# Altium schematic sheet Memory.SchDoc: SDRAM
size A4; Date: 9/24/2014; Author: P.A.; CompanyName: STMicroelectronics; Organization: Microcontrollers Division; Address1: 12, Rue Jules HOROWITZ; Address2: 38019 Grenoble; Address3: FRANCE; DocumentNumber: 9; Revision: B-07; SheetNumber: 9; SheetTotal: 13; Project: STM32F469I-DISCO
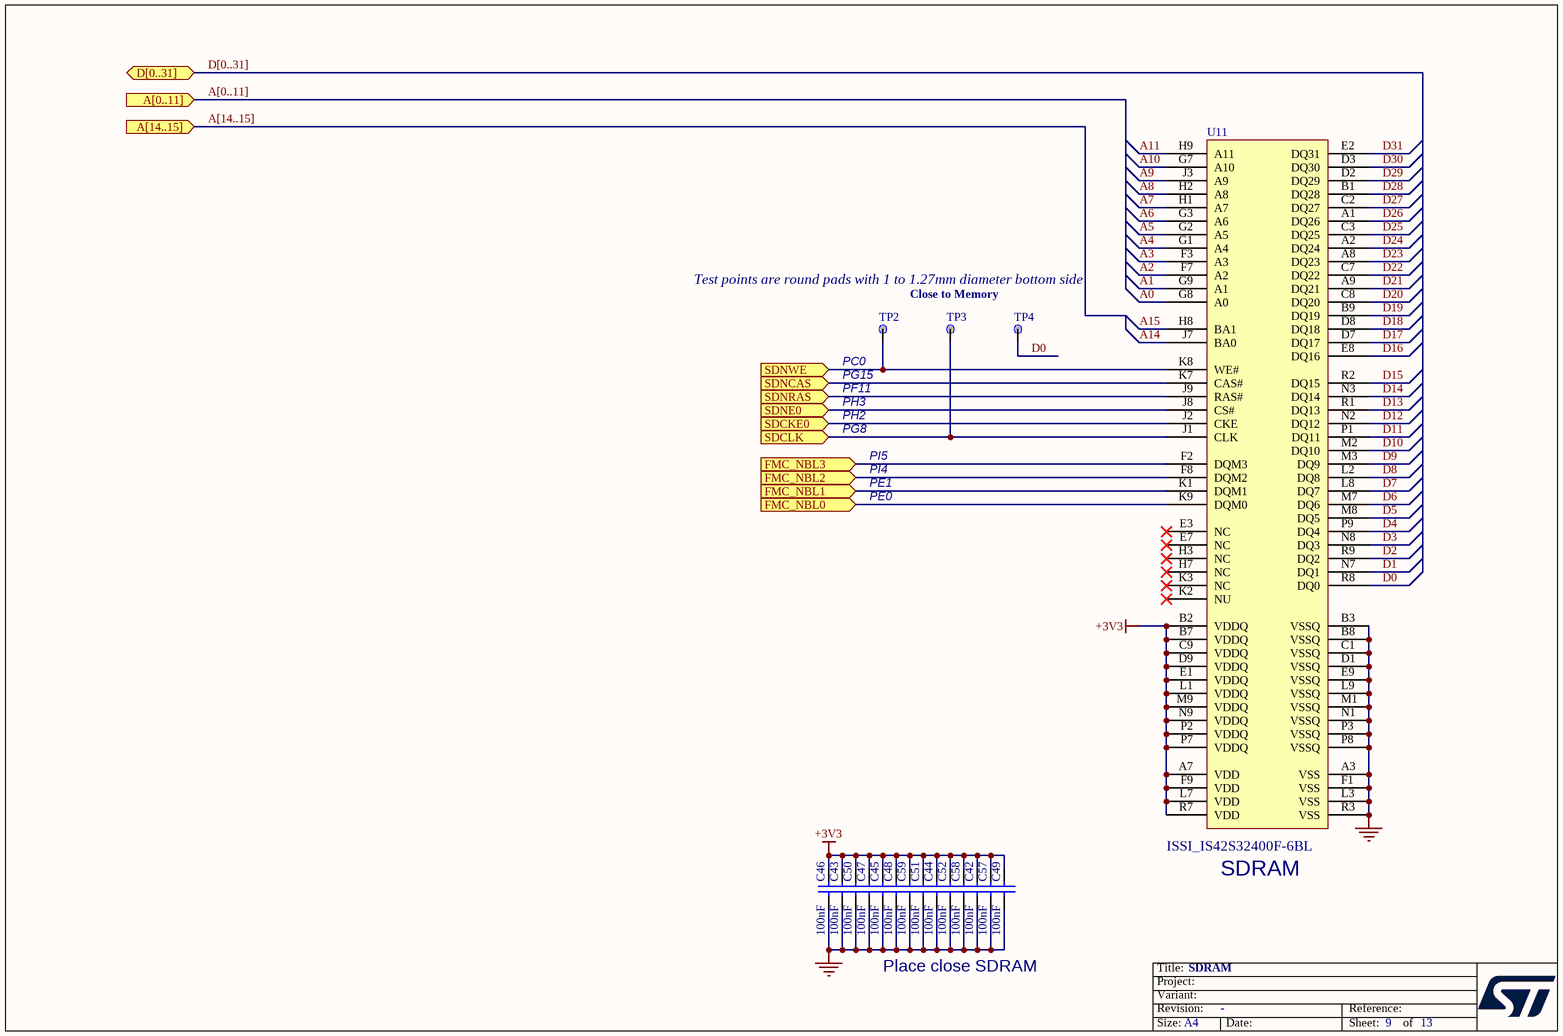
[diagram p0: Memory.SchDoc]

## Parts
C42  100nF  [0402C]
C43  100nF  [0402C]
C44  100nF  [0402C]
C45  100nF  [0402C]
C46  100nF  [0402C]
C47  100nF  [0402C]
C48  100nF  [0402C]
C49  100nF  [0402C]
C50  100nF  [0402C]
C51  100nF  [0402C]
C52  100nF  [0402C]
C57  100nF  [0402C]
C58  100nF  [0402C]
C59  100nF  [0402C]
TP2  TP  [TP_C40]  (value not drawn)
TP3  TP  [TP_C40]  (value not drawn)
TP4  TP  [TP_C40]  (value not drawn)
U11  ISSI_IS42S32400F-6BL  [FBGA90_0R8_8X13]

## Ports
A[0..11] (in), A[14..15] (in), D[0..31] (bidir), FMC_NBL0 (in), FMC_NBL1 (in), FMC_NBL2 (in), FMC_NBL3 (in), SDCKE0 (in), SDCLK (in), SDNCAS (in), SDNE0 (in), SDNRAS (in), SDNWE (in)

## Nets
+3V3: C42.1 C43.1 C44.1 C45.1 C46.1 C47.1 C48.1 C49.1 C50.1 C51.1 C52.1 C57.1 C58.1 C59.1 U11.A7(VDD) U11.B2(VDDQ) U11.B7(VDDQ) U11.C9(VDDQ) U11.D9(VDDQ) U11.E1(VDDQ) U11.F9(VDD) U11.L1(VDDQ) U11.L7(VDD) U11.M9(VDDQ) U11.N9(VDDQ) U11.P2(VDDQ) U11.P7(VDDQ) U11.R7(VDD)
GND: C42.2 C43.2 C44.2 C45.2 C46.2 C47.2 C48.2 C49.2 C50.2 C51.2 C52.2 C57.2 C58.2 C59.2 U11.A3(VSS) U11.B3(VSSQ) U11.B8(VSSQ) U11.C1(VSSQ) U11.D1(VSSQ) U11.E9(VSSQ) U11.F1(VSS) U11.L3(VSS) U11.L9(VSSQ) U11.M1(VSSQ) U11.N1(VSSQ) U11.P3(VSSQ) U11.P8(VSSQ) U11.R3(VSS)
A0: U11.G8(A0)
A1: U11.G9(A1)
A2: U11.F7(A2)
A3: U11.F3(A3)
A4: U11.G1(A4)
A5: U11.G2(A5)
A6: U11.G3(A6)
A7: U11.H1(A7)
A8: U11.H2(A8)
A9: U11.J3(A9)
A10: U11.G7(A10)
A11: U11.H9(A11)
A14: U11.J7(BA0)
A15: U11.H8(BA1)
D0: TP4.1 U11.R8(DQ0)
D1: U11.N7(DQ1)
D2: U11.R9(DQ2)
D3: U11.N8(DQ3)
D4: U11.P9(DQ4)
D5: U11.M8(DQ5)
D6: U11.M7(DQ6)
D7: U11.L8(DQ7)
D8: U11.L2(DQ8)
D9: U11.M3(DQ9)
D10: U11.M2(DQ10)
D11: U11.P1(DQ11)
D12: U11.N2(DQ12)
D13: U11.R1(DQ13)
D14: U11.N3(DQ14)
D15: U11.R2(DQ15)
D16: U11.E8(DQ16)
D17: U11.D7(DQ17)
D18: U11.D8(DQ18)
D19: U11.B9(DQ19)
D20: U11.C8(DQ20)
D21: U11.A9(DQ21)
D22: U11.C7(DQ22)
D23: U11.A8(DQ23)
D24: U11.A2(DQ24)
D25: U11.C3(DQ25)
D26: U11.A1(DQ26)
D27: U11.C2(DQ27)
D28: U11.B1(DQ28)
D29: U11.D2(DQ29)
D30: U11.D3(DQ30)
D31: U11.E2(DQ31)
FMC_NBL0: U11.K9(DQM0) ; port FMC_NBL0
FMC_NBL1: U11.K1(DQM1) ; port FMC_NBL1
FMC_NBL2: U11.F8(DQM2) ; port FMC_NBL2
FMC_NBL3: U11.F2(DQM3) ; port FMC_NBL3
SDCKE0: U11.J2(CKE) ; port SDCKE0
SDCLK: TP3.1 U11.J1(CLK) ; port SDCLK
SDNCAS: U11.K7(CAS#) ; port SDNCAS
SDNE0: U11.J8(CS#) ; port SDNE0
SDNRAS: U11.J9(RAS#) ; port SDNRAS
SDNWE: TP2.1 U11.K8(WE#) ; port SDNWE

Not connected (* = marked no-connect by the designer): U11 E3(NC)* E7(NC)* H3(NC)* H7(NC)* K2(NU)* K3(NC)*

## Buses and harness runs
bus A[0..11] = port A[0..11]
bus A[14..15] = port A[14..15]
bus D[0..31] = port D[0..31]

## Notes on the sheet
- Test points are round pads with 1 to 1.27mm diameter bottom side
- Close to Memory
- (near TP2) PC0
- (near TP2) PG15
- PF11
- PH3
- PH2
- PG8
- PE1
- PE0
- PI5
- PI4
- (near U11) SDRAM
- Place close SDRAM
- Title:
- Project:
- Size:
- Revision:
- Variant:
- A4
- -
- Date:
- Reference:
- Sheet:
- of

## Library data of the parts
C42-C52 C57-C59 = Cap: Capacitor; Value: 10nF; Ordered by: Subcon; Published: 8-Jun-2000; Revision: July-2002: Re-released for DXP Platform.; Publisher: Altium Limited
TP2-TP4 = TP: Ordered by: Subcon
U11 = MT48LC4M32B2B5: Manuf_1: ISSI; Ordered by: Subcon; Manuf_Part_1: IS42S32400F-6BL